# EAGLE design Adafruit MicroUSB Lipo (EAGLE 6.3)
AUTHOR: K. TOWNSEND
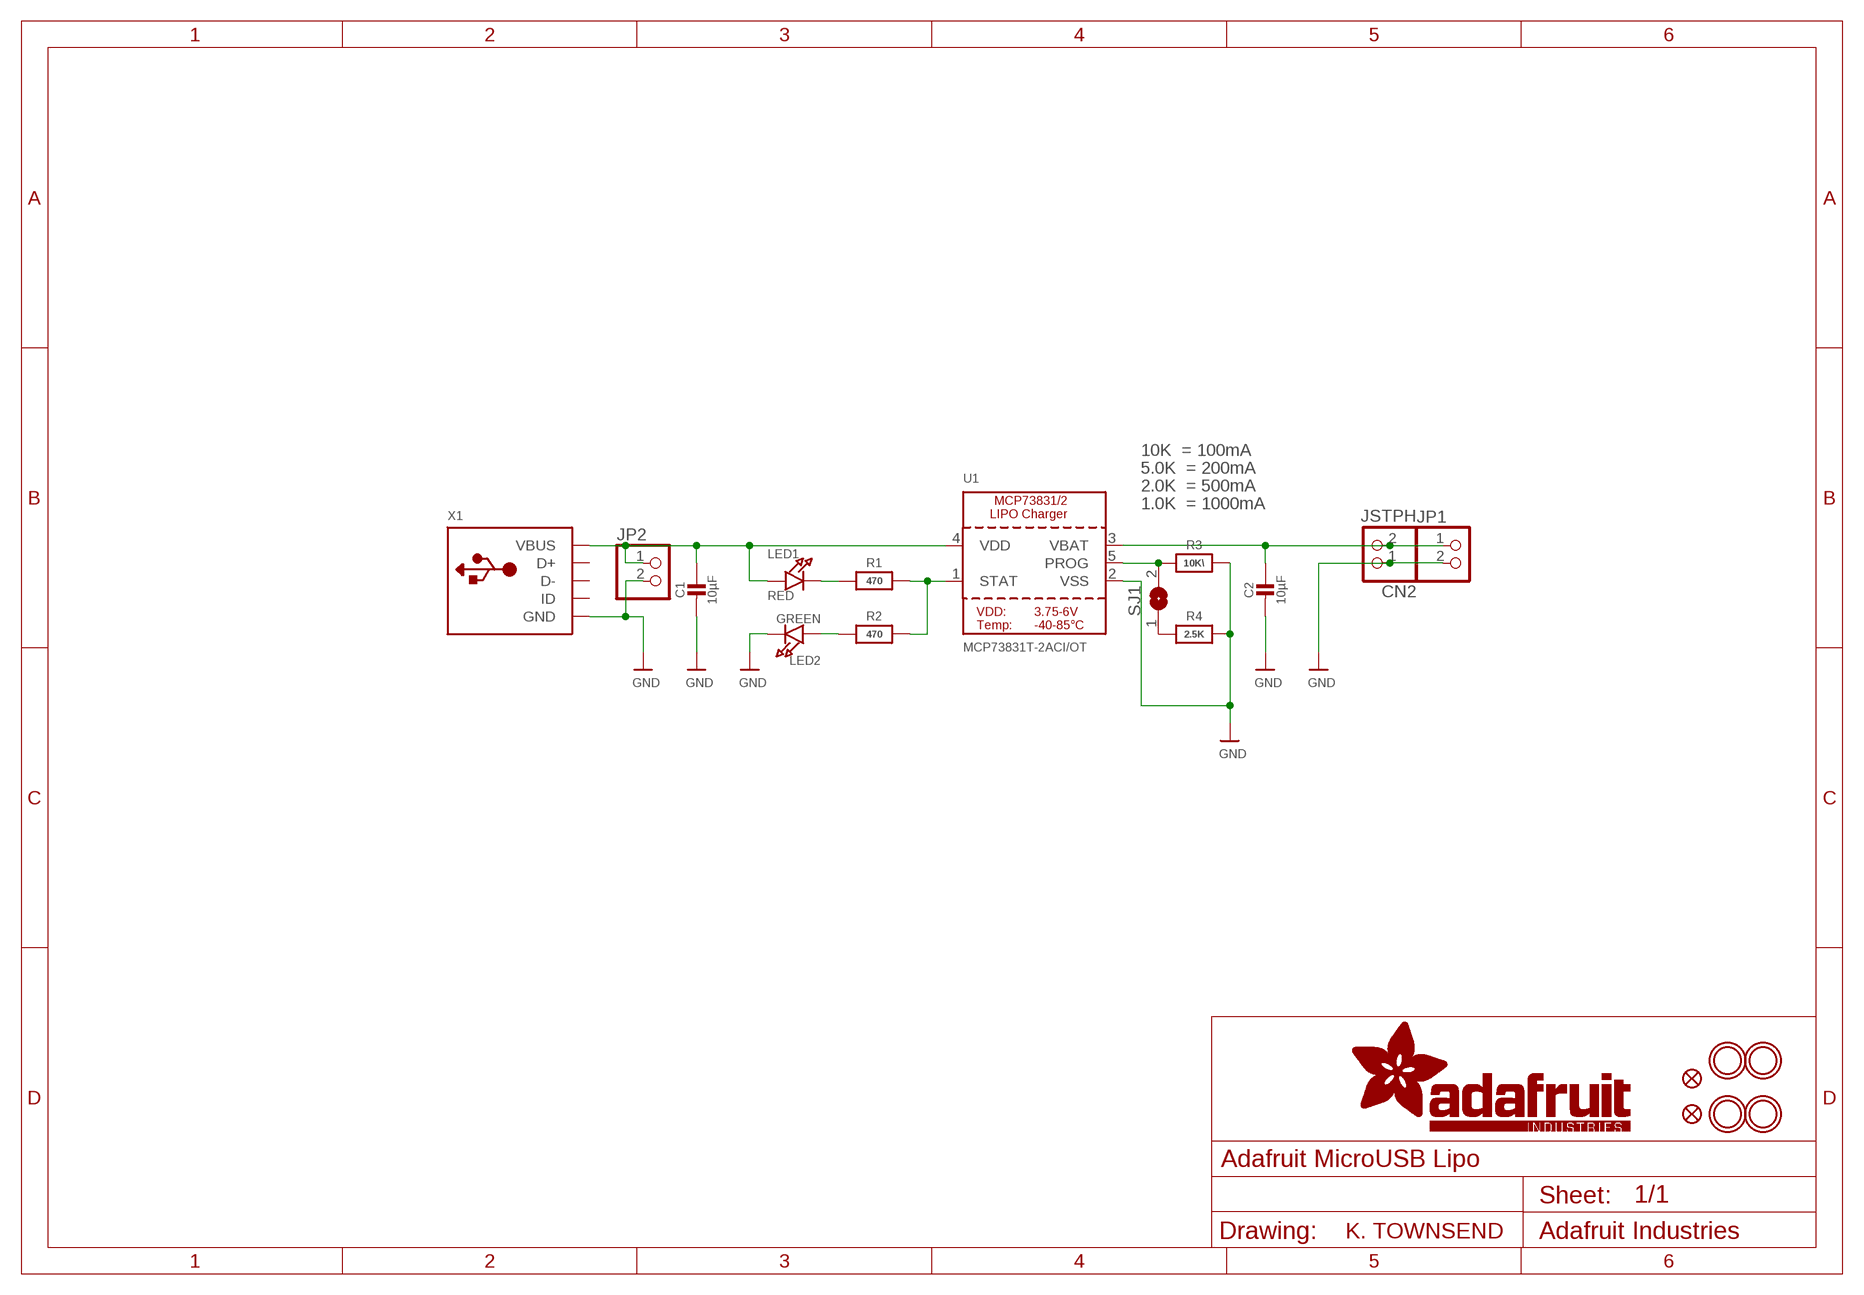
[diagram p0: schematic, sheet 1]

## Parts
C1  10µF  CAP_CERAMIC0805-NOOUTLINE  [0805-NO]
C2  10µF  CAP_CERAMIC0805-NOOUTLINE  [0805-NO]
CN2  JSTPH  JST_2PIN  [JSTPH2]
FID1  FIDUCIAL""  [FIDUCIAL_1MM]
FID2  FIDUCIAL""  [FIDUCIAL_1MM]
JP1  HEADER-1X2ROUND  [1X02_ROUND]
JP2  HEADER-1X2ROUND  [1X02_ROUND]
LED1  RED  LED0805_NOOUTLINE  [CHIPLED_0805_NOOUTLINE]
LED2  GREEN  LED0805_NOOUTLINE  [CHIPLED_0805_NOOUTLINE]
R1  470  RESISTOR0805_NOOUTLINE  [0805-NO]
R2  470  RESISTOR0805_NOOUTLINE  [0805-NO]
R3  10K\  RESISTOR0805_NOOUTLINE  [0805-NO]
R4  2.5K  RESISTOR0805_NOOUTLINE  [0805-NO]
SJ1  SOLDERJUMPER  [SOLDERJUMPER_ARROW_NOPASTE]
U1  MCP73831T-2ACI/OT  MCP73831/2  [SOT23-5]
U$9  MOUNTINGHOLE2.5  [MOUNTINGHOLE_2.5_PLATED]
U$10  MOUNTINGHOLE2.5  [MOUNTINGHOLE_2.5_PLATED]
U$11  MOUNTINGHOLE2.5  [MOUNTINGHOLE_2.5_PLATED]
U$12  MOUNTINGHOLE2.5  [MOUNTINGHOLE_2.5_PLATED]
X1  USBMICRO_20329  [4UCONN_20329]

## Nets
GND: C1.2 C2.2 CN2.1 JP1.2 JP2.2 LED2.C R3.2 R4.2 U1.2(VSS) X1.BASE@1(GND) X1.BASE@2(GND) X1.GND X1.SPRT@1(GND) X1.SPRT@2(GND) X1.SPRT@3(GND) X1.SPRT@4(GND)
N$1: LED1.C R1.1
N$2: R1.2 R2.2 U1.1(STAT)
N$3: R4.1 SJ1.1
N$5: R3.1 SJ1.2 U1.5(PROG)
N$6: LED2.A R2.1
VBAT: C2.1 CN2.2 JP1.1 U1.3(VBAT)
VDD: C1.1 JP2.1 LED1.A U1.4(VDD) X1.VBUS
Unconnected: X1.D+ X1.D- X1.ID

## Notes on the sheet
- 10K  = 100mA
- 5.0K  = 200mA
- 2.0K  = 500mA
- 1.0K  = 1000mA

## Library data of the parts
C1 C2 = microbuilder:CAP_CERAMIC: Ceramic Capacitors For new designs, use the packages preceded by an '_' character since they are more reliable: The following footprints should be used on most boards: _0402 - Standard footprint for regular board layouts _0603 - Standard footprint for regular board layouts _0805 - Standard footprint for regular board layouts _1206 - Standard footprint for regular board layouts For extremely tight-pitch boards where space is at a premium, the following 'micro-pitch' footprints can be used (smaller pads, no silkscreen outline, etc.): _0402MP - Micro-pitch footprint for very dense/compact boards _0603MP - Micro-pitch footprint for very dense/compact boards _0805MP - Micro-pitch footprint for very dense/compact boards _1206MP - Micro-pitch footprint for very dense/compact boards
CN2 = microbuilder:JST_2PIN: JST 2-Pin Right-Angle Connector PH-Series - 4UConnector: 17311 SH-Series - 4UConnector: 07278
FID1 FID2 = microbuilder:FIDUCIAL: Fiducial Alignment Points Various fiducial points for machine vision alignment.; BOM: EXCLUDE
JP1 JP2 = microbuilder:HEADER-1X2: PIN HEADER
LED1 LED2 = microbuilder:LED: LED 0603 - 0603 Surface Mount Package 2mA: Green LED - Low Power (3.9mcd, 2ma, 1.7Vf) - Digikey: 475-2709-2-ND Orange LED - Low Power (9.8mcd, 2ma, 1.8Vf) - Digikey: 475-1194-2-ND Red LED - Low Power (5mcd, 2ma, 1.8Vf) - Digikey: 475-1195-2-ND Yellow LED - Low Power (7mcd, 2ma, 1.8Vf) - Digikey: 475-1196-2-ND 5mA: Blue LED - Low Power (17mcd, 5ma, 2.9Vf) - Digikey: LNJ937W8CRACT-ND 0805 - 0805 Surface Mount Package 2mA: Red LED (8.8mcd, 2mA, 1.8Vf, Clear) - Low Power [Digikey: 475-2510-1-ND] Green LED (5mcd, 2mA, 1.8Vf, Clear) - Low Power [Digikey: 475-2730-1-ND] Yellow LED (11.3mcd, 2mA, 1.8Vf, Clear) - Low Power [Digikey: 475-2555-1-ND] 20mA: Red LED (104mcd, 20mA, Diffused) - LS R976 [Digikey: 475-1278-6-ND] Red LED (12mcd, 20mA, 2.0Vf, Clear) - APT2012EC [Digikey: 754-1128-1-ND] Green LED (15mcd, 20mA, 2.2Vf, Clear) - APT2012GC [Digikey: 754-1131-1-ND] Orange LED (160mcd, 20mA, 2.1Vf, Clear) - APT2012SECK [Digikey: 754-1130-1-ND] 1206 - 1206 Surface Mount Package Green LED (26mcd, 20mA, Diffused) - LG N971 [Digikey: 475-1407-6-ND] Red LED (15mcd, 20mA, Diffused) - LH N974 [Digikey: 475-1416-6-ND] Cree - Cree High-Power Surface Mount LEDs XPEBWT-L1-0000-00D50 - White 111lm 350mA 2.9Vf 6200K 110° XTEAWT-00-0000-00000LEE3 - White 114lm 350mA 2.85Vf 5000K 115° Everlight - Everlight 45-21 Series Surface Mount LEDs 45-21/QK2C-B2832AC2CB2/2T - Warm White 2000mcd 20mA 3.25Vf 3050K 120° 45-21/LK2C-B38452C4CB2/2T - Nuetral White 2000mcd 20mA 3.25Vf 4150K 120° 45-21/LK2C-B50634C6CB2/2T - Cold White 2200mcd 20mA 3.25Vf 5650K 120° PLCC2 Reverse Mount LS T77K-J1L2-1-0-2-R18-Z - Red 11.25mcd 2mA 1.8Vf 630nm 120° LO T77K-L1M2-24-Z - Orange 19.6mcd 2mA 1.8Vf 606nm 120° LY T77K-K2M1-26-Z - Yellow 15.7mcd 2mA 1.8Vf 587nm 120°
R1-R4 = microbuilder:RESISTOR: Resistors For new designs, use the packages preceded by an '_' character since they are more reliable: The following footprints should be used on most boards: _0402 - Standard footprint for regular board layouts _0603 - Standard footprint for regular board layouts _0805 - Standard footprint for regular board layouts _1206 - Standard footprint for regular board layouts For extremely tight-pitch boards where space is at a premium, the following 'micro-pitch' footprints can be used (smaller pads, no silkscreen outline, etc.): _0402MP - Micro-pitch footprint for very dense/compact boards _0603MP - Micro-pitch footprint for very dense/compact boards _0805MP - Micro-pitch footprint for very dense/compact boards _1206MP - Micro-pitch footprint for very dense/compact boards
SJ1 = microbuilder:SOLDERJUMPER: SMD Solder JUMPER Solder the two pads together to create a connection, or remove the solder to break it. REFLOW - Use this footprint for solder paste and reflow ovens. WAVE - Use this footprint for hand-soldering (larger pads). CLOSED - Has a trace between the two pads to ensure it is closed by default. The trace needs to be cut to disable the jumper, and can be closed again by creating a solder bridge between the two pads.; BOM: EXCLUDE
U1 = microbuilder:MCP73831/2: MCP73831/2 LIPO Charger VDD: 3.75 - 6V Temp -40 - 85°C Programmable Charge Rate: 15-500mA NOTE: STAT is a tri-state logic output on the MCP73831 and an open-drain output on the MCP73832. SOT23-5 with 4.2V output and tri-state logic on STAT = MCP73831T-2ACI/OT
U$9-U$12 = microbuilder:MOUNTINGHOLE: Mounting Hole For #2 screws (0.086"/2.18mm width, 0.094"/2.4mm hole) use 2.5mm; BOM: EXCLUDE
X1 = microbuilder:USB: USB Connectors USBMINIB - Surface Mount Female Mini-B USB Connector 4UConnector: 06564

## Board
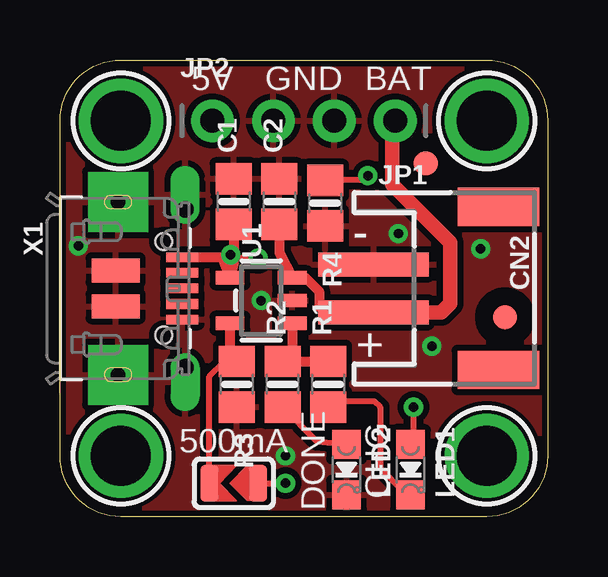
[diagram p1: board, top side]
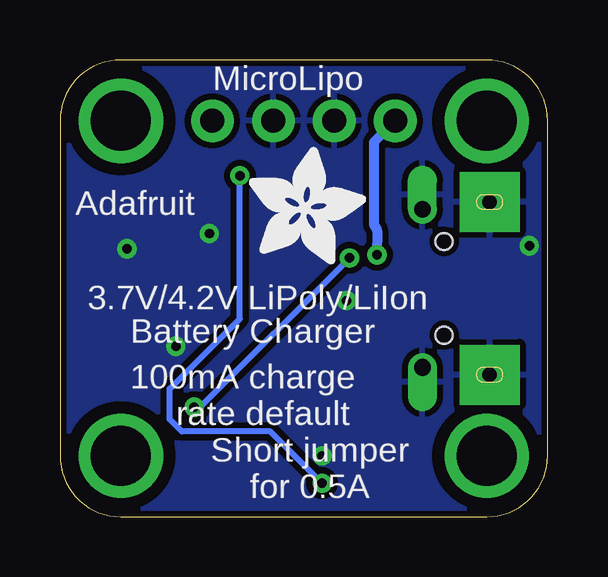
[diagram p2: board, bottom side, seen from below]

Size 20.32 x 19.05 mm. Coordinates in mm from the lower left corner, seen from the top.
Outline: 2.54,19.05 17.78,19.05 arc-90 20.32,16.51 20.32,2.54 arc-90 17.78,0 2.54,0 arc-90 0,2.54 0,16.51 arc-90 2.54,19.05
Copper layers (1*16): Top 0.035mm / dielectric 1.5mm / Bottom 0.035mm
Design rules "adafruit": minimum track width 8mil, minimum drill 15.5mil, track to track 8mil, track to pad 8mil, pad to pad 8mil, via to via 8mil, smd to smd 8mil, copper to edge 10mil, drill to drill 8mil, minimum pad ring 10mil, minimum via ring 8mil, stop-mask expansion 2mil, vias tented up to drill 20mil, thermal gap 10mil

### Footprints (pad centres in the part's own frame; a part is rotated, then mirrored left to right if it is on the bottom)
0805-NO = smd 1.3 x 1.5: 1 -0.95,0; 2 0.95,0
JSTPH2 = smd 1 x 4.6: 1 -1,-3.7; 2 1,-3.7 | smd 1.6 x 3.4: NC1 -3.4,1.5; NC2 3.4,1.5
FIDUCIAL_1MM = smd 1 x 1: 1 0,0
1X02_ROUND = drill 1 pad 1.778: 1 -1.27,0; 2 1.27,0
CHIPLED_0805_NOOUTLINE = smd 1.2 x 1.2: A 0,-1.05; C 0,1.05
SOLDERJUMPER_ARROW_NOPASTE = smd 0.762 x 1.524: 1 -1.016,0; 2 1.016,0
SOT23-5 = smd 0.55 x 1.2: 1 -0.95,-1.3; 2 0,-1.3; 3 0.95,-1.3; 4 0.95,1.3; 5 -0.95,1.3
MOUNTINGHOLE_2.5_PLATED = drill 2.5 pad 3.2: P$1 0,0
4UCONN_20329 = smd 1 x 2: BASE@1 -0.75,-2; BASE@2 0.75,-2 | smd 0.4 x 1.35: D+ 0,0.775; D- -0.65,0.775; GND 1.3,0.775; ID 0.65,0.775; VBUS -1.3,0.775 | drill 0.7 offset: SPRT@1 -3.3,0.9; SPRT@2 3.3,0.9 | drill 0.6 pad 2.5 square: SPRT@3 -3.6,-1.9; SPRT@4 3.6,-1.9 | hole 0.7: -1.95,0; 1.95,0

### Placement (x,y rotation side)
C1  7.24,13.14 90 top
C2  9.14,13.14 90 top
CN2  16.76,9.53 270 top
FID1  18.54,8.32 0 top
FID2  15.24,14.73 0 top
JP1  12.7,16.51 180 top
JP2  7.62,16.51 0 top
LED1  14.61,1.97 180 top
LED2  11.94,1.97 180 top
R1  11.18,5.52 90 top
R2  9.27,5.52 90 top
R3  7.37,5.52 270 top
R4  11.05,13.08 270 top
SJ1  7.24,1.4 180 top
U1  8.38,9.02 90 top
U$9  17.78,2.54 0 top
U$10  17.78,16.51 0 top
U$11  2.54,2.54 0 top
U$12  2.54,16.51 0 top
U$13  [ADAFRUIT_5MM]  12.45,10.54 0 bottom
X1  4.32,9.53 270 top

### Tracks (layer width: path | path; a pad name or v marks a point on that pad's centre or on a via)
GND  (via drill 0.39)
  other vias: 0.76,11.3 8.38,9.02 15.49,7.11 9.4,2.54 17.53,11.18 14.1,11.81
  pour Top (isolate 0.254): -0.13,-0.06 0,19.11 20.32,18.99 20.45,-0.06
  pour Bottom (isolate 0.254): 0,18.92 20.32,18.92 20.45,0 0,0
N$1
  Top 0.254: R1.1 11.43,4.83 13.08,4.83 13.34,4.57 13.34,2.03 14.32,1.05 LED1.C
N$2
  Top 0.406: U1.1 9.68,6.89 R2.2 R1.2
N$3  (via drill 0.39)
  Top 0.254: SJ1.1 v9.4,1.4 | v12.83,14.22 12.63,14.03 R4.1
  Bottom 0.254: v9.4,1.4 11.56,3.56 15.24,3.56 15.75,4.06 15.75,5.33 12.83,8.26 v12.83,14.22
N$5
  Top 0.254: SJ1.2 6.22,5.84 6.86,6.47 R3.1
  Top 0.406: U1.5 7.08,6.76 R3.1
N$6
  Top 0.254: R2.1 10.7,3.15 LED2.A
VBAT
  Top 0.406: C2.1 9.14,11.01 U1.3 10.23,9.97 10.79,9.4 10.79,8.76 11.05,8.51 13.05,8.51 CN2.2
  Top 0.61: CN2.2 15.89,8.53 16.26,8.89 16.26,11.43 13.84,13.84 13.84,16.38 JP1.1
VDD  (via drill 0.39)
  Top 0.254: v8.26,10.79 5.59,10.82 | LED1.A 14.73,3.27 v14.73,4.57
  Top 0.406: X1.VBUS 5.59,10.82 6.73,10.82 U1.4 7.21,10.52 | C1.1 7.24,10.63 7.21,10.52 | v7.11,10.92 6.88,10.52 7.21,10.52
  Bottom 0.254: v8.26,10.79 14.48,4.57 v14.73,4.57
  Bottom 0.406: JP2.1 7.24,15.62 C1.1 7.11,11.94 v7.11,10.92

### Text on the board
tPlace: 5V | GND | BAT | - | + | 500mA | CHG | DONE
bPlace: MicroLipo | Adafruit | 3.7V/4.2V LiPoly/LiIon | Battery Charger | 100mA charge | rate default | Short jumper / for 0.5A